# EAGLE design BLDC (EAGLE 9.0.0)
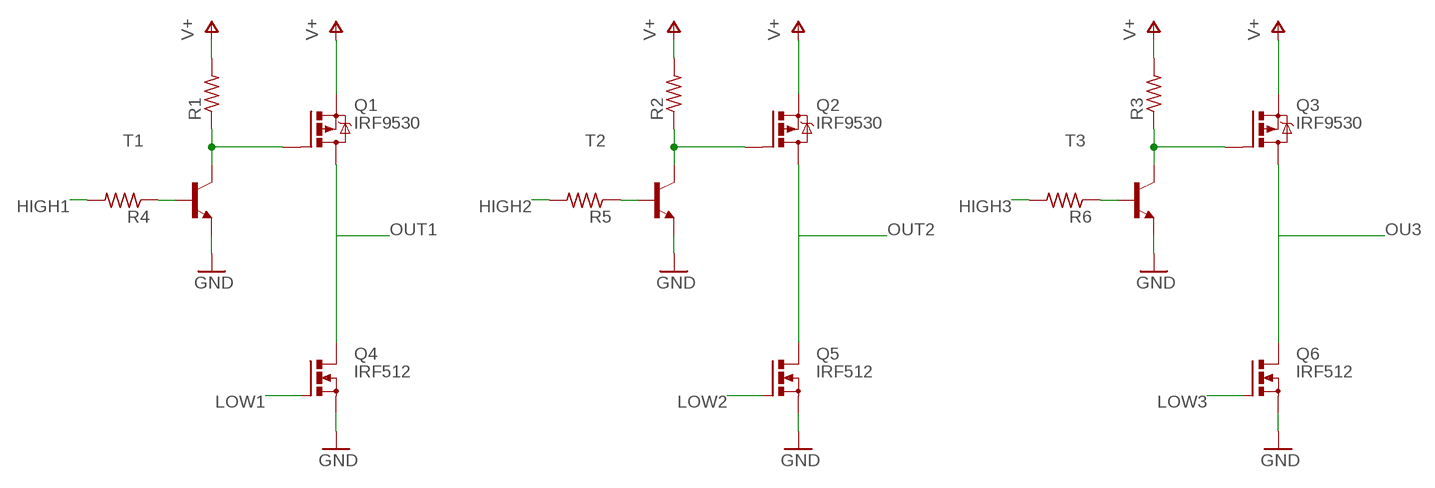
[diagram p0: schematic, sheet 1]

## Parts
Q1  IRF9530  [TO220BV]
Q2  IRF9530  [TO220BV]
Q3  IRF9530  [TO220BV]
Q4  IRF512  [TO220BV]
Q5  IRF512  [TO220BV]
Q6  IRF512  [TO220BV]
R1  R-US_0204/7  [0204/7]
R2  R-US_0204/7  [0204/7]
R3  R-US_0204/7  [0204/7]
R4  R-US_0204/7  [0204/7]
R5  R-US_0204/7  [0204/7]
R6  R-US_0204/7  [0204/7]
T1  -NPN-TO92-BEC  [TO92-BEC]
T2  -NPN-TO92-BEC  [TO92-BEC]
T3  -NPN-TO92-BEC  [TO92-BEC]

## Nets
GND: Q4.S Q5.S Q6.S T1.E T2.E T3.E
HIGH1: R4.2
HIGH2: R5.2
HIGH3: R6.2
LOW1: Q4.G
LOW2: Q5.G
LOW3: Q6.G
N$1: Q2.G R2.1 T2.C
N$2: Q1.G R1.1 T1.C
N$3: Q3.G R3.1 T3.C
N$4: R4.1 T1.B
N$5: R5.1 T2.B
N$6: R6.1 T3.B
OU3: Q3.D Q6.D
OUT1: Q1.D Q4.D
OUT2: Q2.D Q5.D
V+ [POWER]: Q1.S Q2.S Q3.S R1.2 R2.2 R3.2

## Library data of the parts
Q1-Q3 = transistor-power:IRF9530: P-CHANNEL HEXFET POWER-MOS-FET Source: http://www.irf.com/product-info/datasheets/data/irf9530.pdf
Q4-Q6 = transistor-power:IRF512: N-CHANNEL MOS FET
R1-R6 = rcl:R-US_: RESISTOR, American symbol; SPICEPREFIX: R
T1-T3 = DC_LOAD_AU:*-NPN-: NPN Transistror BF959 corrected 2008.03.06

## Net classes
1 POWER: width 1.524 mm, drill 1.524 mm, clearance 1.524 mm

## Board
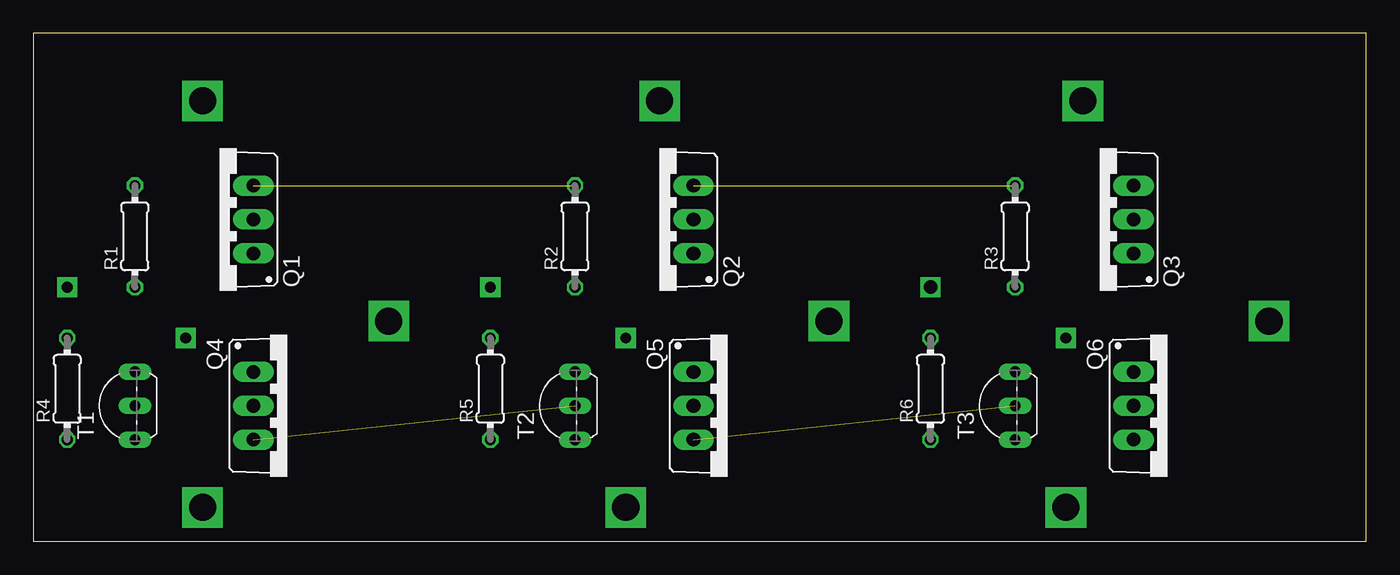
[diagram p1: board, top side]
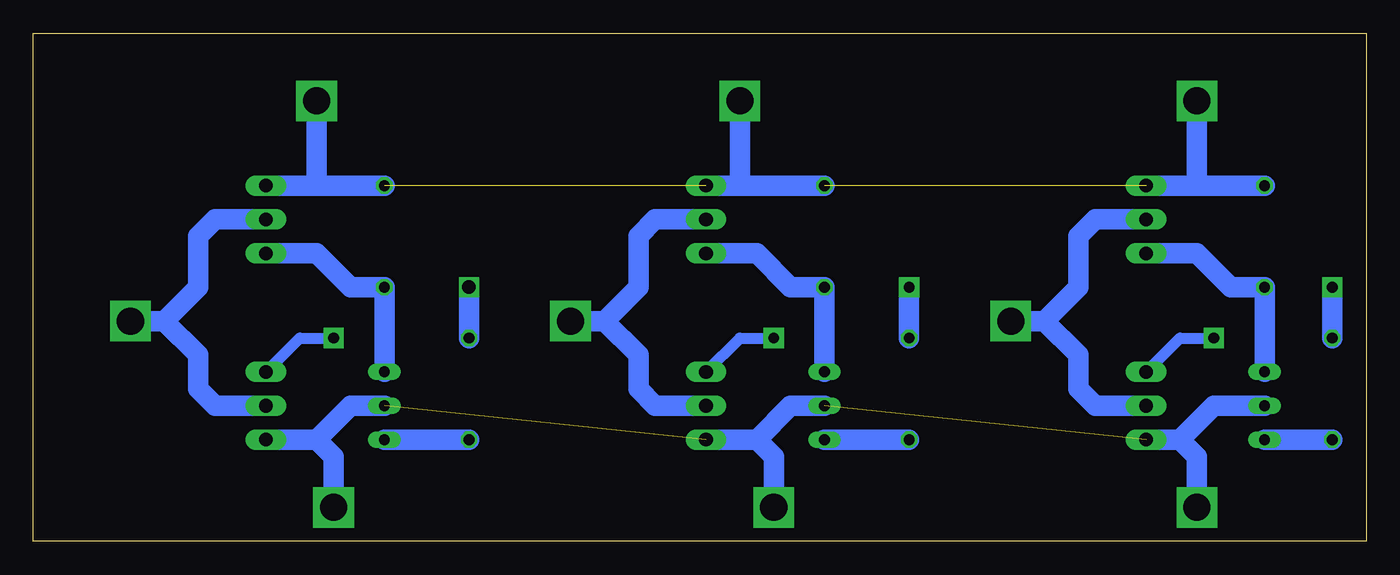
[diagram p2: board, bottom side, seen from below]

Size 100 x 38.09 mm. Coordinates in mm from the lower left corner, seen from the top.
Outline: 0,0 100,0 100,38.09 0,38.09 0,0
Copper layers (1*16): Top 0.0356mm / dielectric 1.5011mm / Bottom 0.0356mm
Design rules "IEEE-Medium": minimum track width 10mil, minimum drill 32mil, track to track 32mil, track to pad 10mil, pad to pad 10mil, via to via 10mil, smd to smd 10mil, copper to edge 15mil, drill to drill 10mil, minimum pad ring 7mil, minimum via ring 7mil, stop-mask expansion 2.5mil, vias tented up to drill 0mil, thermal gap 20mil

### Footprints (pad centres in the part's own frame; a part is rotated, then mirrored left to right if it is on the bottom)
TO220BV = drill 1.016 long: D 0,-2.54; G -2.54,-2.54; S 2.54,-2.54
0204/7 = drill 0.813 octagon: 1 -3.81,0; 2 3.81,0
TO92-BEC = drill 0.813 long: B -2.54,0; C 2.54,0; E 0,0

### Placement (x,y rotation side)
Q1  13.97,24.13 90 top
Q2  46.99,24.13 90 top
Q3  80.01,24.13 90 top
Q4  19.05,10.16 270 top
Q5  52.07,10.16 270 top
Q6  85.09,10.16 270 top
R1  7.62,22.86 90 top
R2  40.64,22.86 90 top
R3  73.66,22.86 90 top
R4  2.54,11.43 90 top
R5  34.29,11.43 90 top
R6  67.31,11.43 90 top
T1  7.62,10.16 90 top
T2  40.64,10.16 90 top
T3  73.66,10.16 90 top

### Tracks (layer width: path | path; a pad name or v marks a point on that pad's centre or on a via)
GND  (via drill 2.03 pad 3.05)  (2 unrouted)
  Bottom 1.524: T3.E 76.2,10.16 78.74,7.62 | T1.E 11.43,10.16 13.97,7.62 | T2.E 43.18,10.16 45.72,7.62 | Q4.S 13.97,7.62 | Q5.S 45.72,7.62 | Q6.S 78.74,7.62 | 13.97,7.62 12.7,6.35 v12.7,2.54 | 45.72,7.62 44.45,6.35 v44.45,2.54 | 78.74,7.62 77.47,6.35 v77.47,2.54
HIGH1  (via drill 0.81 pad 1.52)
  Bottom 1.524: R4.2 v2.54,19.05
HIGH2  (via drill 0.81 pad 1.52)
  Bottom 1.524: R5.2 v34.29,19.05
HIGH3  (via drill 1.02 pad 1.52)
  Bottom 1.524: R6.2 v67.31,19.05
LOW1  (via drill 0.81 pad 1.52)
  Bottom 0.813: Q4.G 13.97,15.24 v11.43,15.24
LOW2  (via drill 0.81 pad 1.52)
  Bottom 0.813: Q5.G 46.99,15.24 v44.45,15.24
LOW3  (via drill 0.81 pad 1.52)
  Bottom 0.813: Q6.G 80.01,15.24 v77.47,15.24
N$1
  Bottom 1.524: Q2.G 45.72,21.59 43.18,19.05 R2.1 T2.C
N$2
  Bottom 1.524: T1.C R1.1 10.16,19.05 12.7,21.59 Q1.G
N$3
  Bottom 1.524: T3.C R3.1 76.2,19.05 78.74,21.59 Q3.G
N$4
  Bottom 1.524: T1.B R4.1
N$5
  Bottom 1.524: T2.B R5.1
N$6
  Bottom 1.524: T3.B R6.1
OU3  (via drill 2.03 pad 3.05)
  Bottom 1.524: Q3.D 86.36,24.13 87.63,22.86 87.63,19.05 90.17,16.51 | 90.17,16.51 87.63,13.97 87.63,11.43 86.36,10.16 Q6.D | 90.17,16.51 v92.71,16.51
OUT1  (via drill 2.03 pad 3.05)
  Bottom 1.524: Q1.D 20.32,24.13 21.59,22.86 21.59,19.05 24.13,16.51 | 24.13,16.51 21.59,13.97 21.59,11.43 20.32,10.16 Q4.D | 24.13,16.51 v26.67,16.51
OUT2  (via drill 2.03 pad 3.05)
  Bottom 1.524: Q2.D 53.34,24.13 54.61,22.86 54.61,19.05 57.15,16.51 | 57.15,16.51 54.61,13.97 54.61,11.43 53.34,10.16 Q5.D | 57.15,16.51 v59.69,16.51
V+  (via drill 2.03 pad 3.05)  (2 unrouted)
  Bottom 1.524: Q3.S 78.74,26.67 | 78.74,26.67 R3.2 | 78.74,26.67 v78.74,33.02 | Q1.S 12.7,26.67 | 12.7,26.67 R1.2 | 12.7,26.67 v12.7,33.02 | Q2.S 46.99,26.67 | 46.99,26.67 R2.2 | 46.99,26.67 v46.99,33.02